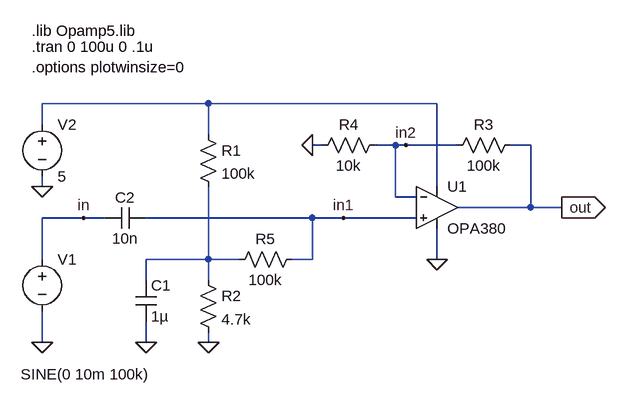
[diagram p0: schematic opa380_test.asc]
opa380_test.asc, the LTspice schematic file:
Version 4
SHEET 1 880 680
WIRE -112 16 -368 16
WIRE 240 16 -112 16
WIRE -368 48 -368 16
WIRE -112 64 -112 16
WIRE 64 80 48 80
WIRE 176 80 144 80
WIRE 192 80 176 80
WIRE 272 80 192 80
WIRE 384 80 352 80
WIRE -368 144 -368 128
WIRE 240 144 240 16
WIRE 176 160 176 80
WIRE 208 160 176 160
WIRE 384 176 384 80
WIRE 384 176 272 176
WIRE 432 176 384 176
WIRE -304 192 -368 192
WIRE -272 192 -304 192
WIRE 48 192 -208 192
WIRE 96 192 48 192
WIRE 208 192 96 192
WIRE -368 256 -368 192
WIRE -112 256 -112 144
WIRE -112 256 -208 256
WIRE -64 256 -112 256
WIRE 48 256 48 192
WIRE 48 256 16 256
WIRE 240 256 240 208
WIRE -208 288 -208 256
WIRE -112 288 -112 256
WIRE -368 384 -368 336
WIRE -208 384 -208 352
WIRE -112 384 -112 368
FLAG -112 384 0
FLAG 240 256 0
FLAG 48 80 0
FLAG -208 384 0
FLAG -368 384 0
FLAG 432 176 out
IOPIN 432 176 Out
FLAG -368 144 0
FLAG -304 192 in
FLAG 96 192 in1
FLAG 192 80 in2
SYMBOL Opamps\\opamp2 240 112 R0
SYMATTR InstName U1
SYMATTR Value OPA380
SYMBOL res -128 48 R0
SYMATTR InstName R1
SYMATTR Value 100k
SYMBOL res -128 272 R0
SYMATTR InstName R2
SYMATTR Value 4.7k
SYMBOL res 256 96 R270
WINDOW 0 32 56 VTop 0
WINDOW 3 0 56 VBottom 0
SYMATTR InstName R3
SYMATTR Value 100k
SYMBOL res 48 96 R270
WINDOW 0 32 56 VTop 0
WINDOW 3 0 56 VBottom 0
SYMATTR InstName R4
SYMATTR Value 10k
SYMBOL res -80 272 R270
WINDOW 0 32 56 VTop 0
WINDOW 3 0 56 VBottom 0
SYMATTR InstName R5
SYMATTR Value 100k
SYMBOL cap -224 288 R0
SYMATTR InstName C1
SYMATTR Value 1µ
SYMBOL cap -272 208 R270
WINDOW 0 32 32 VTop 0
WINDOW 3 0 32 VBottom 0
SYMATTR InstName C2
SYMATTR Value 10n
SYMBOL voltage -368 240 R0
WINDOW 3 -33 193 Left 0
WINDOW 123 0 0 Left 0
WINDOW 39 0 0 Left 0
SYMATTR Value SINE(0 10m 100k)
SYMATTR InstName V1
SYMBOL voltage -368 32 R0
SYMATTR InstName V2
SYMATTR Value 5
TEXT -384 -96 Left 0 !.lib Opamp5.lib
TEXT -384 -72 Left 0 !.tran 0 100u 0 .1u
TEXT -384 -40 Left 0 !.options plotwinsize=0

The netlist it stands for:
* opa380_test.asc
XU1 in1 in2 N001 0 out OPA380  ; pins In+ In- V+ V- OUT
R1 N001 N002 100k
R2 N002 0 4.7k
R3 in2 out 100k
R4 0 in2 10k
R5 N002 in1 100k
C1 N002 0 1µ
C2 in in1 10n
V1 in 0 SINE(0 10m 100k)
V2 N001 0 5
.lib Opamp5.lib
.tran 0 100u 0 .1u
.options plotwinsize=0
.backanno
.end